# EAGLE schematic foo (EAGLE 4.11)
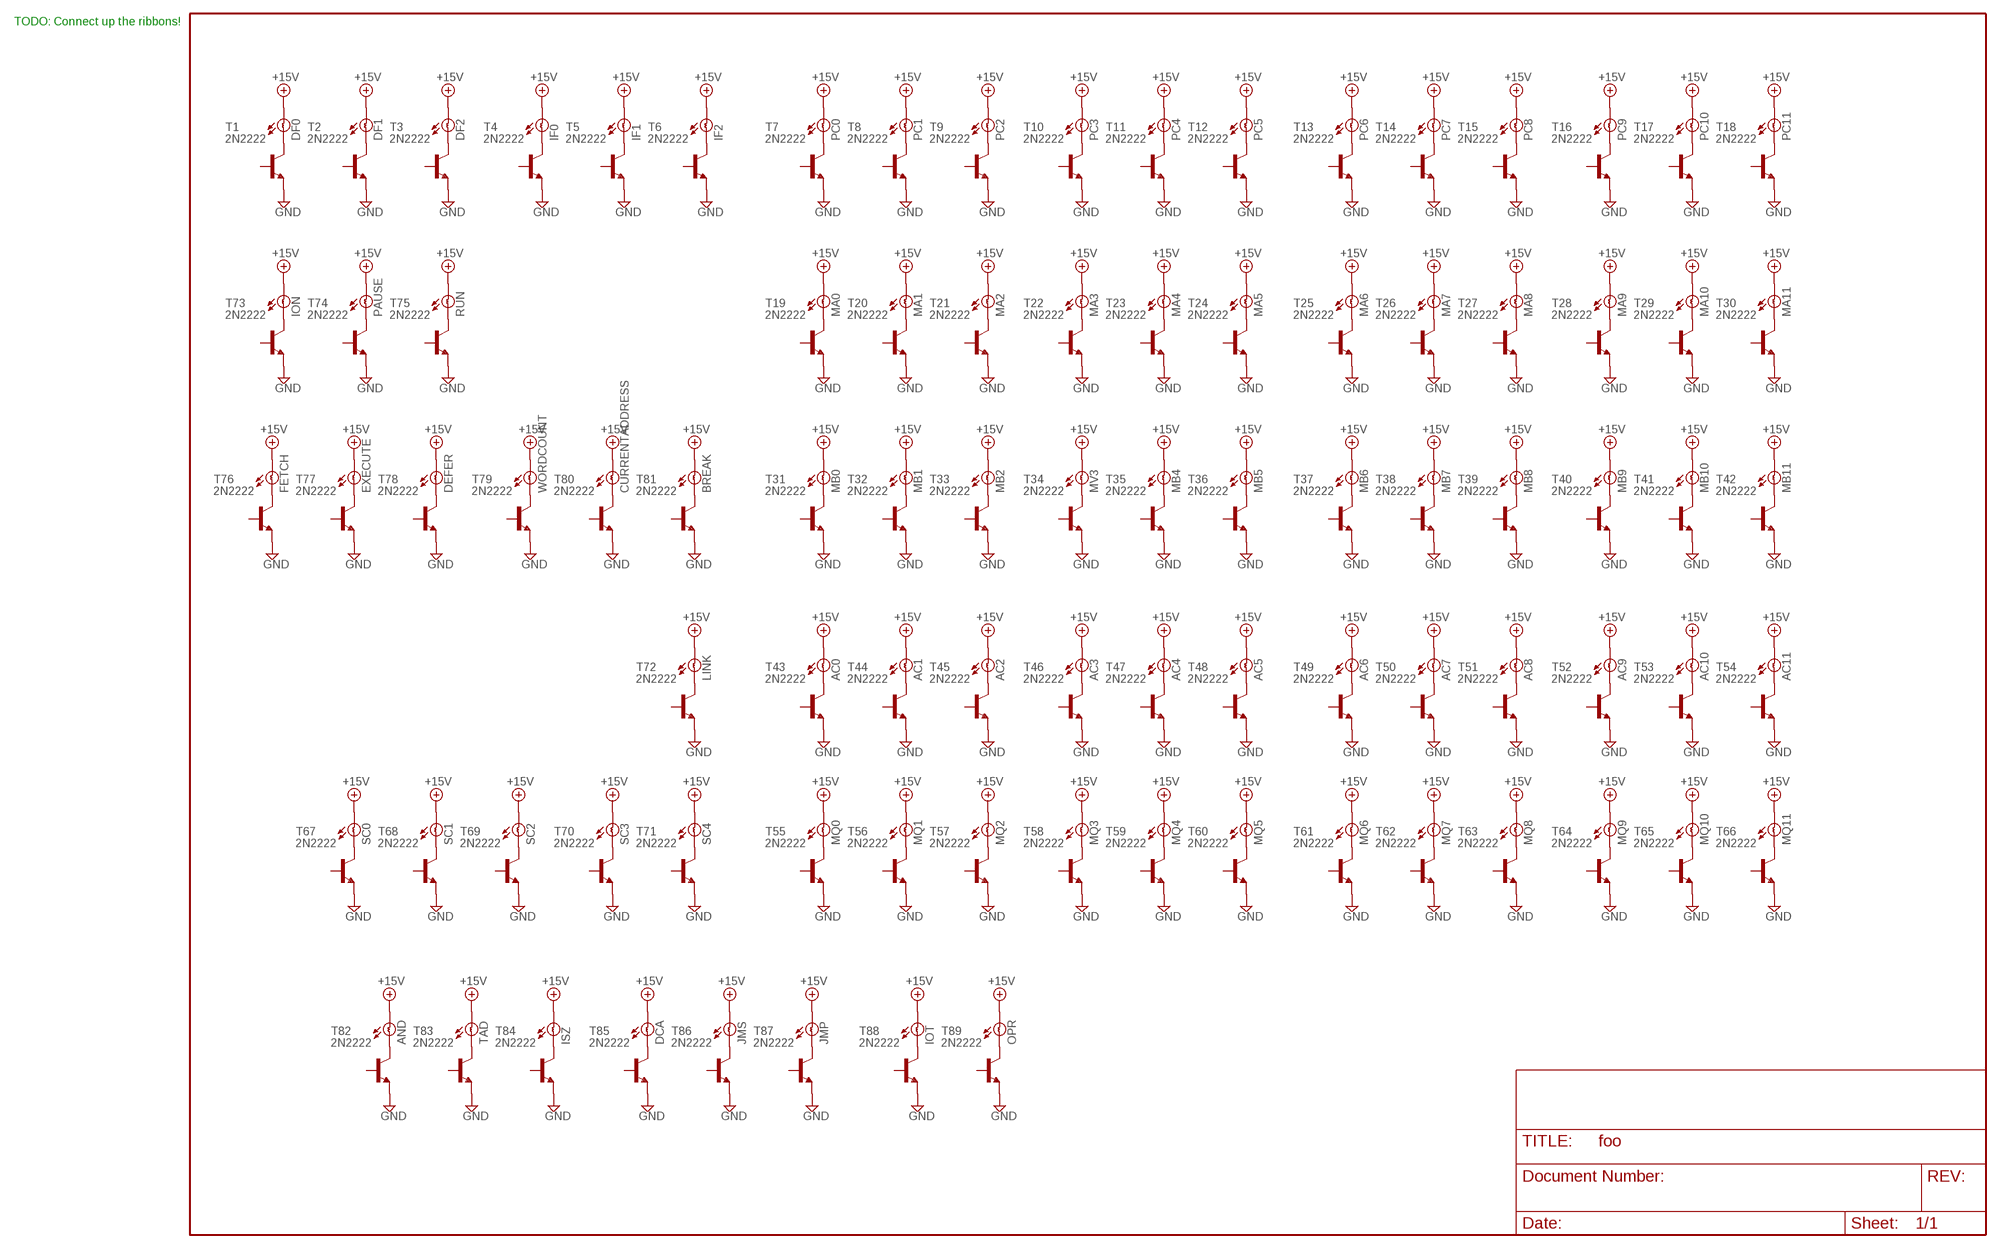
[diagram p0: schematic, sheet 1]

## Parts
AC0  BULB  [BULB]
AC1  BULB  [BULB]
AC2  BULB  [BULB]
AC3  BULB  [BULB]
AC4  BULB  [BULB]
AC5  BULB  [BULB]
AC6  BULB  [BULB]
AC7  BULB  [BULB]
AC8  BULB  [BULB]
AC9  BULB  [BULB]
AC10  BULB  [BULB]
AC11  BULB  [BULB]
AND  BULB  [BULB]
BREAK  BULB  [BULB]
CURRENTADDRESS  BULB  [BULB]
DCA  BULB  [BULB]
DEFER  BULB  [BULB]
DF0  BULB  [BULB]
DF1  BULB  [BULB]
DF2  BULB  [BULB]
EXECUTE  BULB  [BULB]
FETCH  BULB  [BULB]
IF0  BULB  [BULB]
IF1  BULB  [BULB]
IF2  BULB  [BULB]
ION  BULB  [BULB]
IOT  BULB  [BULB]
ISZ  BULB  [BULB]
JMP  BULB  [BULB]
JMS  BULB  [BULB]
LINK  BULB  [BULB]
MA0  BULB  [BULB]
MA1  BULB  [BULB]
MA2  BULB  [BULB]
MA3  BULB  [BULB]
MA4  BULB  [BULB]
MA5  BULB  [BULB]
MA6  BULB  [BULB]
MA7  BULB  [BULB]
MA8  BULB  [BULB]
MA9  BULB  [BULB]
MA10  BULB  [BULB]
MA11  BULB  [BULB]
MB0  BULB  [BULB]
MB1  BULB  [BULB]
MB2  BULB  [BULB]
MB4  BULB  [BULB]
MB5  BULB  [BULB]
MB6  BULB  [BULB]
MB7  BULB  [BULB]
MB8  BULB  [BULB]
MB9  BULB  [BULB]
MB10  BULB  [BULB]
MB11  BULB  [BULB]
MQ0  BULB  [BULB]
MQ1  BULB  [BULB]
MQ2  BULB  [BULB]
MQ3  BULB  [BULB]
MQ4  BULB  [BULB]
MQ5  BULB  [BULB]
MQ6  BULB  [BULB]
MQ7  BULB  [BULB]
MQ8  BULB  [BULB]
MQ9  BULB  [BULB]
MQ10  BULB  [BULB]
MQ11  BULB  [BULB]
MV3  BULB  [BULB]
OPR  BULB  [BULB]
PAUSE  BULB  [BULB]
PC0  BULB  [BULB]
PC1  BULB  [BULB]
PC2  BULB  [BULB]
PC3  BULB  [BULB]
PC4  BULB  [BULB]
PC5  BULB  [BULB]
PC6  BULB  [BULB]
PC7  BULB  [BULB]
PC8  BULB  [BULB]
PC9  BULB  [BULB]
PC10  BULB  [BULB]
PC11  BULB  [BULB]
RUN  BULB  [BULB]
SC0  BULB  [BULB]
SC1  BULB  [BULB]
SC2  BULB  [BULB]
SC3  BULB  [BULB]
SC4  BULB  [BULB]
T1  2N2222  -NPN-TO92  [TO92]
T2  2N2222  -NPN-TO92  [TO92]
T3  2N2222  -NPN-TO92  [TO92]
T4  2N2222  -NPN-TO92  [TO92]
T5  2N2222  -NPN-TO92  [TO92]
T6  2N2222  -NPN-TO92  [TO92]
T7  2N2222  -NPN-TO92  [TO92]
T8  2N2222  -NPN-TO92  [TO92]
T9  2N2222  -NPN-TO92  [TO92]
T10  2N2222  -NPN-TO92  [TO92]
T11  2N2222  -NPN-TO92  [TO92]
T12  2N2222  -NPN-TO92  [TO92]
T13  2N2222  -NPN-TO92  [TO92]
T14  2N2222  -NPN-TO92  [TO92]
T15  2N2222  -NPN-TO92  [TO92]
T16  2N2222  -NPN-TO92  [TO92]
T17  2N2222  -NPN-TO92  [TO92]
T18  2N2222  -NPN-TO92  [TO92]
T19  2N2222  -NPN-TO92  [TO92]
T20  2N2222  -NPN-TO92  [TO92]
T21  2N2222  -NPN-TO92  [TO92]
T22  2N2222  -NPN-TO92  [TO92]
T23  2N2222  -NPN-TO92  [TO92]
T24  2N2222  -NPN-TO92  [TO92]
T25  2N2222  -NPN-TO92  [TO92]
T26  2N2222  -NPN-TO92  [TO92]
T27  2N2222  -NPN-TO92  [TO92]
T28  2N2222  -NPN-TO92  [TO92]
T29  2N2222  -NPN-TO92  [TO92]
T30  2N2222  -NPN-TO92  [TO92]
T31  2N2222  -NPN-TO92  [TO92]
T32  2N2222  -NPN-TO92  [TO92]
T33  2N2222  -NPN-TO92  [TO92]
T34  2N2222  -NPN-TO92  [TO92]
T35  2N2222  -NPN-TO92  [TO92]
T36  2N2222  -NPN-TO92  [TO92]
T37  2N2222  -NPN-TO92  [TO92]
T38  2N2222  -NPN-TO92  [TO92]
T39  2N2222  -NPN-TO92  [TO92]
T40  2N2222  -NPN-TO92  [TO92]
T41  2N2222  -NPN-TO92  [TO92]
T42  2N2222  -NPN-TO92  [TO92]
T43  2N2222  -NPN-TO92  [TO92]
T44  2N2222  -NPN-TO92  [TO92]
T45  2N2222  -NPN-TO92  [TO92]
T46  2N2222  -NPN-TO92  [TO92]
T47  2N2222  -NPN-TO92  [TO92]
T48  2N2222  -NPN-TO92  [TO92]
T49  2N2222  -NPN-TO92  [TO92]
T50  2N2222  -NPN-TO92  [TO92]
T51  2N2222  -NPN-TO92  [TO92]
T52  2N2222  -NPN-TO92  [TO92]
T53  2N2222  -NPN-TO92  [TO92]
T54  2N2222  -NPN-TO92  [TO92]
T55  2N2222  -NPN-TO92  [TO92]
T56  2N2222  -NPN-TO92  [TO92]
T57  2N2222  -NPN-TO92  [TO92]
T58  2N2222  -NPN-TO92  [TO92]
T59  2N2222  -NPN-TO92  [TO92]
T60  2N2222  -NPN-TO92  [TO92]
T61  2N2222  -NPN-TO92  [TO92]
T62  2N2222  -NPN-TO92  [TO92]
T63  2N2222  -NPN-TO92  [TO92]
T64  2N2222  -NPN-TO92  [TO92]
T65  2N2222  -NPN-TO92  [TO92]
T66  2N2222  -NPN-TO92  [TO92]
T67  2N2222  -NPN-TO92  [TO92]
T68  2N2222  -NPN-TO92  [TO92]
T69  2N2222  -NPN-TO92  [TO92]
T70  2N2222  -NPN-TO92  [TO92]
T71  2N2222  -NPN-TO92  [TO92]
T72  2N2222  -NPN-TO92  [TO92]
T73  2N2222  -NPN-TO92  [TO92]
T74  2N2222  -NPN-TO92  [TO92]
T75  2N2222  -NPN-TO92  [TO92]
T76  2N2222  -NPN-TO92  [TO92]
T77  2N2222  -NPN-TO92  [TO92]
T78  2N2222  -NPN-TO92  [TO92]
T79  2N2222  -NPN-TO92  [TO92]
T80  2N2222  -NPN-TO92  [TO92]
T81  2N2222  -NPN-TO92  [TO92]
T82  2N2222  -NPN-TO92  [TO92]
T83  2N2222  -NPN-TO92  [TO92]
T84  2N2222  -NPN-TO92  [TO92]
T85  2N2222  -NPN-TO92  [TO92]
T86  2N2222  -NPN-TO92  [TO92]
T87  2N2222  -NPN-TO92  [TO92]
T88  2N2222  -NPN-TO92  [TO92]
T89  2N2222  -NPN-TO92  [TO92]
TAD  BULB  [BULB]
WORDCOUNT  BULB  [BULB]

## Nets
+15V [supply]: AC0.A AC1.A AC2.A AC3.A AC4.A AC5.A AC6.A AC7.A AC8.A AC9.A AC10.A AC11.A AND.A BREAK.A CURRENTADDRESS.A DCA.A DEFER.A DF0.A DF1.A DF2.A EXECUTE.A FETCH.A IF0.A IF1.A IF2.A ION.A IOT.A ISZ.A JMP.A JMS.A LINK.A MA0.A MA1.A MA2.A MA3.A MA4.A MA5.A MA6.A MA7.A MA8.A MA9.A MA10.A MA11.A MB0.A MB1.A MB2.A MB4.A MB5.A MB6.A MB7.A MB8.A MB9.A MB10.A MB11.A MQ0.A MQ1.A MQ2.A MQ3.A MQ4.A MQ5.A MQ6.A MQ7.A MQ8.A MQ9.A MQ10.A MQ11.A MV3.A OPR.A PAUSE.A PC0.A PC1.A PC2.A PC3.A PC4.A PC5.A PC6.A PC7.A PC8.A PC9.A PC10.A PC11.A RUN.A SC0.A SC1.A SC2.A SC3.A SC4.A TAD.A WORDCOUNT.A
GND [supply]: T1.1(E) T2.1(E) T3.1(E) T4.1(E) T5.1(E) T6.1(E) T7.1(E) T8.1(E) T9.1(E) T10.1(E) T11.1(E) T12.1(E) T13.1(E) T14.1(E) T15.1(E) T16.1(E) T17.1(E) T18.1(E) T19.1(E) T20.1(E) T21.1(E) T22.1(E) T23.1(E) T24.1(E) T25.1(E) T26.1(E) T27.1(E) T28.1(E) T29.1(E) T30.1(E) T31.1(E) T32.1(E) T33.1(E) T34.1(E) T35.1(E) T36.1(E) T37.1(E) T38.1(E) T39.1(E) T40.1(E) T41.1(E) T42.1(E) T43.1(E) T44.1(E) T45.1(E) T46.1(E) T47.1(E) T48.1(E) T49.1(E) T50.1(E) T51.1(E) T52.1(E) T53.1(E) T54.1(E) T55.1(E) T56.1(E) T57.1(E) T58.1(E) T59.1(E) T60.1(E) T61.1(E) T62.1(E) T63.1(E) T64.1(E) T65.1(E) T66.1(E) T67.1(E) T68.1(E) T69.1(E) T70.1(E) T71.1(E) T72.1(E) T73.1(E) T74.1(E) T75.1(E) T76.1(E) T77.1(E) T78.1(E) T79.1(E) T80.1(E) T81.1(E) T82.1(E) T83.1(E) T84.1(E) T85.1(E) T86.1(E) T87.1(E) T88.1(E) T89.1(E)
N$1: DF0.B T1.3(C)
N$2: DF1.B T2.3(C)
N$3: DF2.B T3.3(C)
N$4: IF0.B T4.3(C)
N$5: IF1.B T5.3(C)
N$6: IF2.B T6.3(C)
N$7: PC0.B T7.3(C)
N$8: PC1.B T8.3(C)
N$9: PC2.B T9.3(C)
N$10: PC3.B T10.3(C)
N$11: PC4.B T11.3(C)
N$12: PC5.B T12.3(C)
N$13: PC6.B T13.3(C)
N$14: PC7.B T14.3(C)
N$15: PC8.B T15.3(C)
N$16: PC9.B T16.3(C)
N$17: PC10.B T17.3(C)
N$18: PC11.B T18.3(C)
N$19: MA0.B T19.3(C)
N$20: MA1.B T20.3(C)
N$21: MA2.B T21.3(C)
N$22: MA3.B T22.3(C)
N$23: MA4.B T23.3(C)
N$24: MA5.B T24.3(C)
N$25: MA6.B T25.3(C)
N$26: MA7.B T26.3(C)
N$27: MA8.B T27.3(C)
N$28: MA9.B T28.3(C)
N$29: MA10.B T29.3(C)
N$30: MA11.B T30.3(C)
N$31: MB0.B T31.3(C)
N$32: MB1.B T32.3(C)
N$33: MB2.B T33.3(C)
N$34: MV3.B T34.3(C)
N$35: MB4.B T35.3(C)
N$36: MB5.B T36.3(C)
N$37: MB6.B T37.3(C)
N$38: MB7.B T38.3(C)
N$39: MB8.B T39.3(C)
N$40: MB9.B T40.3(C)
N$41: MB10.B T41.3(C)
N$42: MB11.B T42.3(C)
N$43: AC0.B T43.3(C)
N$44: AC1.B T44.3(C)
N$45: AC2.B T45.3(C)
N$46: AC3.B T46.3(C)
N$47: AC4.B T47.3(C)
N$48: AC5.B T48.3(C)
N$49: AC6.B T49.3(C)
N$50: AC7.B T50.3(C)
N$51: AC8.B T51.3(C)
N$52: AC9.B T52.3(C)
N$53: AC10.B T53.3(C)
N$54: AC11.B T54.3(C)
N$55: MQ0.B T55.3(C)
N$56: MQ1.B T56.3(C)
N$57: MQ2.B T57.3(C)
N$58: MQ3.B T58.3(C)
N$59: MQ4.B T59.3(C)
N$60: MQ5.B T60.3(C)
N$61: MQ6.B T61.3(C)
N$62: MQ7.B T62.3(C)
N$63: MQ8.B T63.3(C)
N$64: MQ9.B T64.3(C)
N$65: MQ10.B T65.3(C)
N$66: MQ11.B T66.3(C)
N$67: SC0.B T67.3(C)
N$68: SC1.B T68.3(C)
N$69: SC2.B T69.3(C)
N$70: SC3.B T70.3(C)
N$71: SC4.B T71.3(C)
N$72: LINK.B T72.3(C)
N$73: ION.B T73.3(C)
N$74: PAUSE.B T74.3(C)
N$75: RUN.B T75.3(C)
N$76: FETCH.B T76.3(C)
N$77: EXECUTE.B T77.3(C)
N$78: DEFER.B T78.3(C)
N$79: T79.3(C) WORDCOUNT.B
N$80: CURRENTADDRESS.B T80.3(C)
N$81: BREAK.B T81.3(C)
N$82: AND.B T82.3(C)
N$83: T83.3(C) TAD.B
N$84: ISZ.B T84.3(C)
N$85: DCA.B T85.3(C)
N$86: JMS.B T86.3(C)
N$87: JMP.B T87.3(C)
N$88: IOT.B T88.3(C)
N$89: OPR.B T89.3(C)
Unconnected: T1.2(B) T2.2(B) T3.2(B) T4.2(B) T5.2(B) T6.2(B) T7.2(B) T8.2(B) T9.2(B) T10.2(B) T11.2(B) T12.2(B) T13.2(B) T14.2(B) T15.2(B) T16.2(B) T17.2(B) T18.2(B) T19.2(B) T20.2(B) T21.2(B) T22.2(B) T23.2(B) T24.2(B) T25.2(B) T26.2(B) T27.2(B) T28.2(B) T29.2(B) T30.2(B) T31.2(B) T32.2(B) T33.2(B) T34.2(B) T35.2(B) T36.2(B) T37.2(B) T38.2(B) T39.2(B) T40.2(B) T41.2(B) T42.2(B) T43.2(B) T44.2(B) T45.2(B) T46.2(B) T47.2(B) T48.2(B) T49.2(B) T50.2(B) T51.2(B) T52.2(B) T53.2(B) T54.2(B) T55.2(B) T56.2(B) T57.2(B) T58.2(B) T59.2(B) T60.2(B) T61.2(B) T62.2(B) T63.2(B) T64.2(B) T65.2(B) T66.2(B) T67.2(B) T68.2(B) T69.2(B) T70.2(B) T71.2(B) T72.2(B) T73.2(B) T74.2(B) T75.2(B) T76.2(B) T77.2(B) T78.2(B) T79.2(B) T80.2(B) T81.2(B) T82.2(B) T83.2(B) T84.2(B) T85.2(B) T86.2(B) T87.2(B) T88.2(B) T89.2(B)

## Notes on the sheet
- TODO: Connect up the ribbons!

## Library data of the parts
AC0 AC1-AC11 AND BREAK CURRENTADDRESS DCA DEFER DF0 DF1 DF2 EXECUTE FETCH IF0 IF1 IF2 ION IOT ISZ JMP JMS LINK MA0 MA1-MA11 MB0 MB1 MB2 MB4-MB11 MQ0 MQ1-MQ11 MV3 OPR PAUSE PC0 PC1-PC11 RUN SC0 SC1-SC4 TAD WORDCOUNT = dec-con:BULB: LED OSRAM: - CHIPLED LG R971, LG N971, LY N971, LG Q971, LY Q971, LO R971, LY R971 LH N974, LH R974 LS Q976, LO Q976, LY Q976 LO Q996 - Hyper CHIPLED LW Q18S LB Q993, LB Q99A, LB R99A - SideLED LS A670, LO A670, LY A670, LG A670, LP A670 LB A673, LV A673, LT A673, LW A673 LH A674 LY A675 LS A676, LA A676, LO A676, LY A676, LW A676 LS A679, LY A679, LG A679 - Hyper Micro SIDELED® LS Y876, LA Y876, LO Y876, LY Y876 LT Y87S - SmartLED LW L88C, LW L88S LB L89C, LB L89S, LG L890 LS L89K, LO L89K, LY L89K LS L896, LA L896, LO L896, LY L896 - TOPLED LS T670, LO T670, LY T670, LG T670, LP T670 LSG T670, LSP T670, LSY T670, LOP T670, LYG T670 LG T671, LOG T671, LSG T671 LB T673, LV T673, LT T673, LW T673 LH T674 LS T676, LA T676, LO T676, LY T676, LB T676, LH T676, LSB T676, LW T676 LB T67C, LV T67C, LT T67C, LS T67K, LO T67K, LY T67K, LW E67C LS E67B, LA E67B, LO E67B, LY E67B, LB E67C, LV E67C, LT E67C LW T67C LS T679, LY T679, LG T679 LS T770, LO T770, LY T770, LG T770, LP T770 LB T773, LV T773, LT T773, LW T773 LH T774 LS E675, LA E675, LY E675, LS T675 LS T776, LA T776, LO T776, LY T776, LB T776 LHGB T686 LT T68C, LB T68C - Hyper Mini TOPLED® LB M676 - Mini TOPLED Santana® LG M470 LS M47K, LO M47K, LY M47K Source: http://www.osram.convergy.de/
T1-T89 = transistor:*-NPN-: NPN Transistror

## Net classes
1 supply: width 0.762 mm